# EAGLE design clock_board (EAGLE 7.5.0)
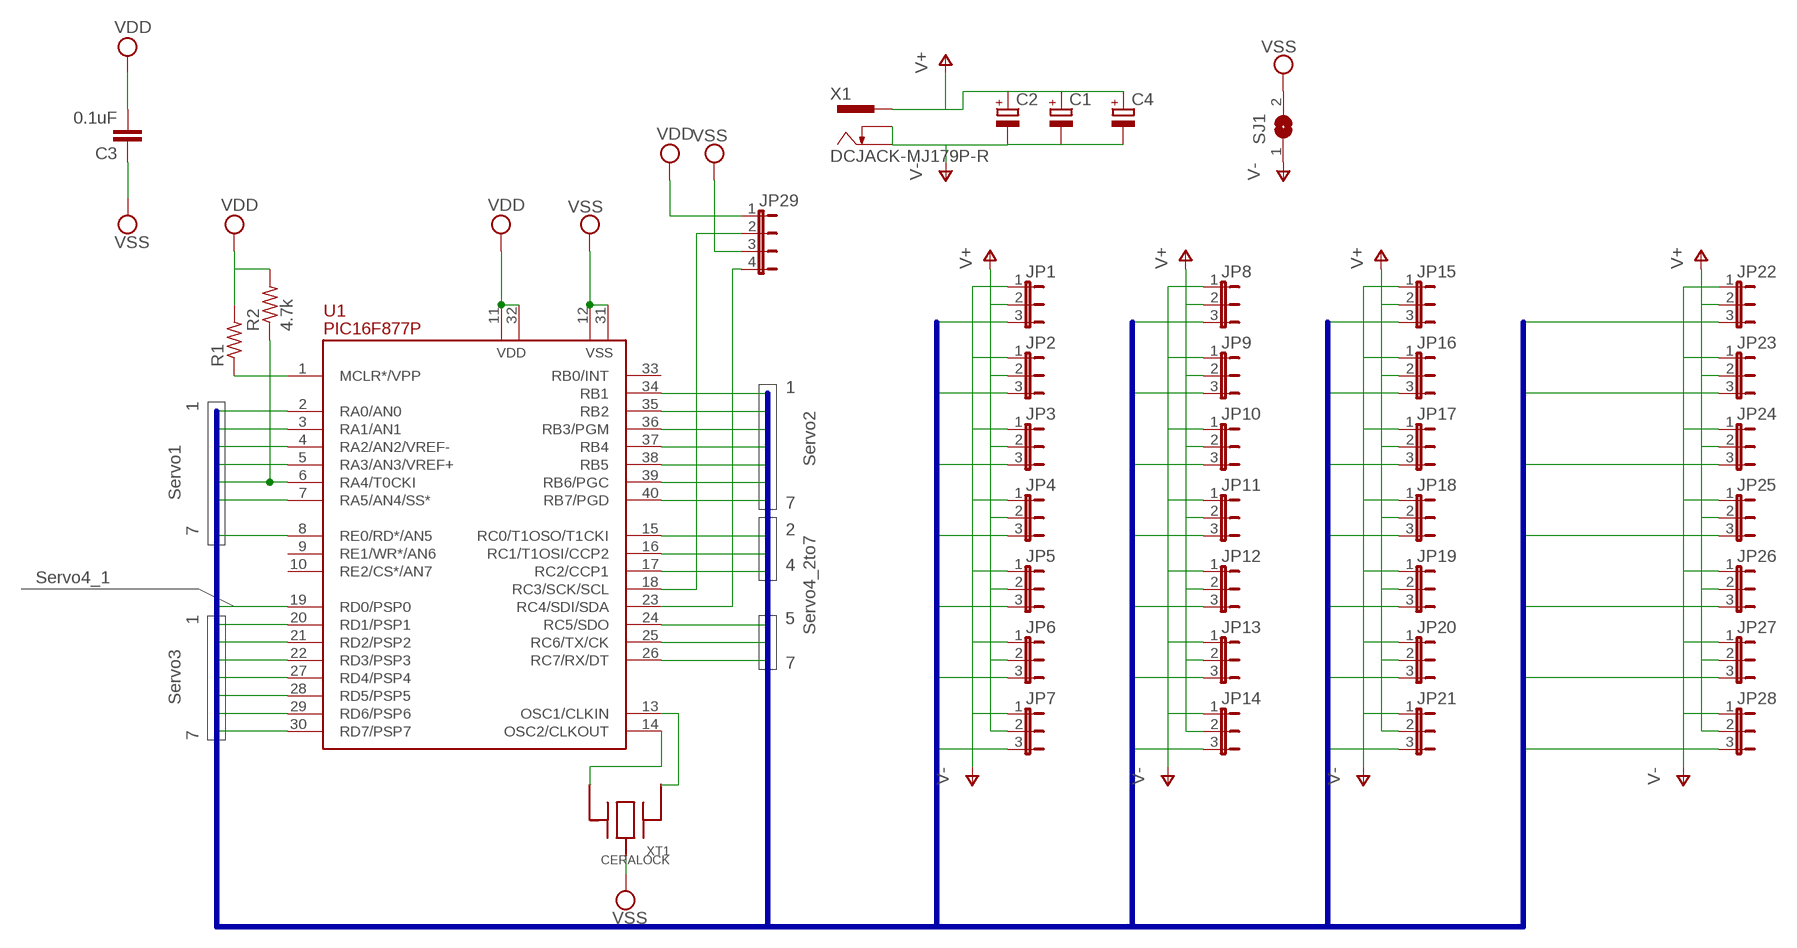
[diagram p0: schematic, sheet 1]

## Parts
C1  CPOL-EUE2.5-5  [E2,5-5]
C2  CPOL-EUE2.5-5  [E2,5-5]
C3  0.1uF  C-EU025-024X044  [C025-024X044]
C4  CPOL-EUE2.5-5  [E2,5-5]
JP1  JP2E  [JP2]
JP2  JP2E  [JP2]
JP3  JP2E  [JP2]
JP4  JP2E  [JP2]
JP5  JP2E  [JP2]
JP6  JP2E  [JP2]
JP7  JP2E  [JP2]
JP8  JP2E  [JP2]
JP9  JP2E  [JP2]
JP10  JP2E  [JP2]
JP11  JP2E  [JP2]
JP12  JP2E  [JP2]
JP13  JP2E  [JP2]
JP14  JP2E  [JP2]
JP15  JP2E  [JP2]
JP16  JP2E  [JP2]
JP17  JP2E  [JP2]
JP18  JP2E  [JP2]
JP19  JP2E  [JP2]
JP20  JP2E  [JP2]
JP21  JP2E  [JP2]
JP22  JP2E  [JP2]
JP23  JP2E  [JP2]
JP24  JP2E  [JP2]
JP25  JP2E  [JP2]
JP26  JP2E  [JP2]
JP27  JP2E  [JP2]
JP28  JP2E  [JP2]
JP29  JP4E  [JP4]
R1  R-US_0207/10  [0207/10]
R2  4.7k  R-US_0207/10  [0207/10]
SJ1  SJW  [SJW]
U1  PIC16F877P  [DIL40]
X1  DCJACK-MJ179P-R  [MJ-179P-R]
XT1  CERALOCK  [CERALOCK]

## Nets
N$1: U1.14(OSC2/CLKOUT) XT1.P$3
N$2: U1.13(OSC1/CLKIN) XT1.P$1
N$3: R1.1 U1.1(MCLR*/VPP)
N$4: JP29.2 U1.18(RC3/SCK/SCL)
N$5: JP29.4 U1.23(RC4/SDI/SDA)
SERVO0: JP1.3 U1.2(RA0/AN0)
SERVO1: JP2.3 U1.3(RA1/AN1)
SERVO2: JP3.3 U1.4(RA2/AN2/VREF-)
SERVO3: JP4.3 U1.5(RA3/AN3/VREF+)
SERVO4: JP5.3 R2.1 U1.6(RA4/T0CKI)
SERVO5: JP6.3 U1.7(RA5/AN4/SS*)
SERVO6: JP7.3 U1.8(RE0/RD*/AN5)
SERVO7: JP8.3 U1.34(RB1)
SERVO8: JP9.3 U1.35(RB2)
SERVO9: JP10.3 U1.36(RB3/PGM)
SERVO10: JP11.3 U1.37(RB4)
SERVO11: JP12.3 U1.38(RB5)
SERVO12: JP13.3 U1.39(RB6/PGC)
SERVO13: JP14.3 U1.40(RB7/PGD)
SERVO14: JP15.3 U1.20(RD1/PSP1)
SERVO15: JP16.3 U1.21(RD2/PSP2)
SERVO16: JP17.3 U1.22(RD3/PSP3)
SERVO17: JP18.3 U1.27(RD4/PSP4)
SERVO18: JP19.3 U1.28(RD5/PSP5)
SERVO19: JP20.3 U1.29(RD6/PSP6)
SERVO20: JP21.3 U1.30(RD7/PSP7)
SERVO21: JP22.3 U1.19(RD0/PSP0)
SERVO22: JP23.3 U1.15(RC0/T1OSO/T1CKI)
SERVO23: JP24.3 U1.16(RC1/T1OSI/CCP2)
SERVO24: JP25.3 U1.17(RC2/CCP1)
SERVO25: JP26.3 U1.24(RC5/SDO)
SERVO26: JP27.3 U1.25(RC6/TX/CK)
SERVO27: JP28.3 U1.26(RC7/RX/DT)
V+: C1.+ C2.+ C4.+ JP1.2 JP2.2 JP3.2 JP4.2 JP5.2 JP6.2 JP7.2 JP8.2 JP9.2 JP10.2 JP11.2 JP12.2 JP13.2 JP14.2 JP15.2 JP16.2 JP17.2 JP18.2 JP19.2 JP20.2 JP21.2 JP22.2 JP23.2 JP24.2 JP25.2 JP26.2 JP27.2 JP28.2 X1.1
V-: C1.- C2.- C4.- JP1.1 JP2.1 JP3.1 JP4.1 JP5.1 JP6.1 JP7.1 JP8.1 JP9.1 JP10.1 JP11.1 JP12.1 JP13.1 JP14.1 JP15.1 JP16.1 JP17.1 JP18.1 JP19.1 JP20.1 JP21.1 JP22.1 JP23.1 JP24.1 JP25.1 JP26.1 JP27.1 JP28.1 SJ1.1 X1.2 X1.3
VDD: C3.2 JP29.1 R1.2 R2.2 U1.11(VDD) U1.32(VDD)
VSS: C3.1 JP29.3 SJ1.2 U1.12(VSS) U1.31(VSS) XT1.P$2
Unconnected: U1.9(RE1/WR*/AN6) U1.10(RE2/CS*/AN7) U1.33(RB0/INT)

## Buses
SERVO[0..27]

## Notes on the sheet
- 1
- 1 | Servo2
- Servo1
- 7
- 7 | 2 | Servo4_2to7
- Servo4_1 | 4
- 1 | 5
- 7
- Servo3
- 7

## Library data of the parts
C1 C2 C4 = rcl:CPOL-EU: POLARIZED CAPACITOR, European symbol
C3 = rcl:C-EU: CAPACITOR, European symbol
JP1-JP28 = jumper:JP2E: JUMPER
JP29 = jumper:JP4E: JUMPER
R1 R2 = rcl:R-US_: RESISTOR, American symbol
SJ1 = jumper:SJ: SMD solder JUMPER
U1 = pic16f87x:PIC16F877: FLASH MICROCONTROLLER
X1 = dcjack:DCJACK: DC JACK 2.1mmφ - 5.5mmφ DCジャック、基板用。
XT1 = serolock:CERALOCK

## Board
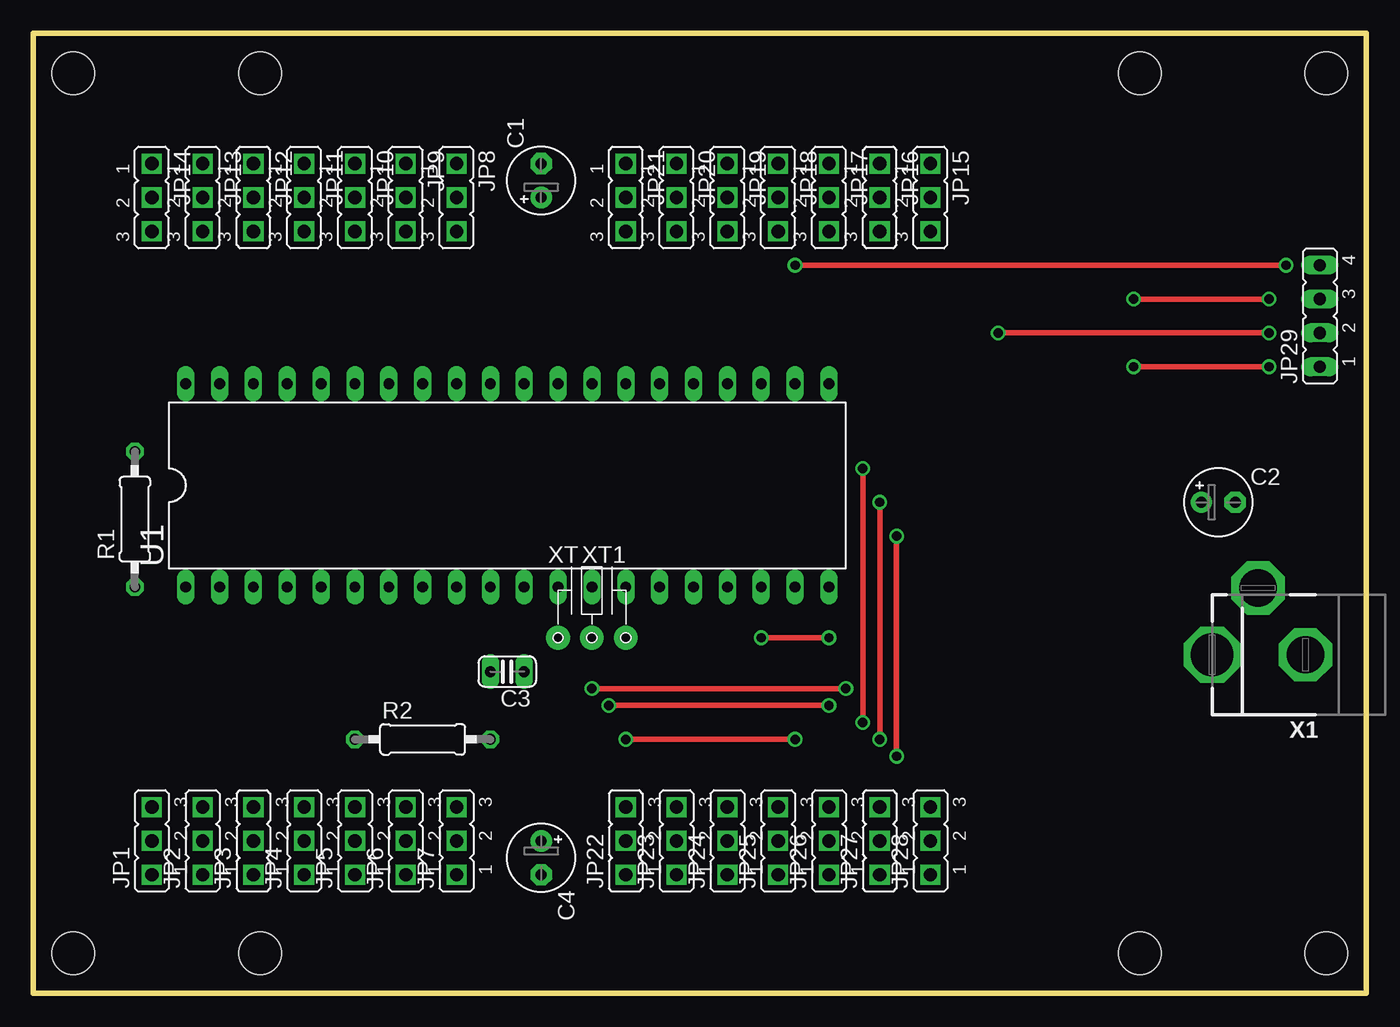
[diagram p1: board, top side]
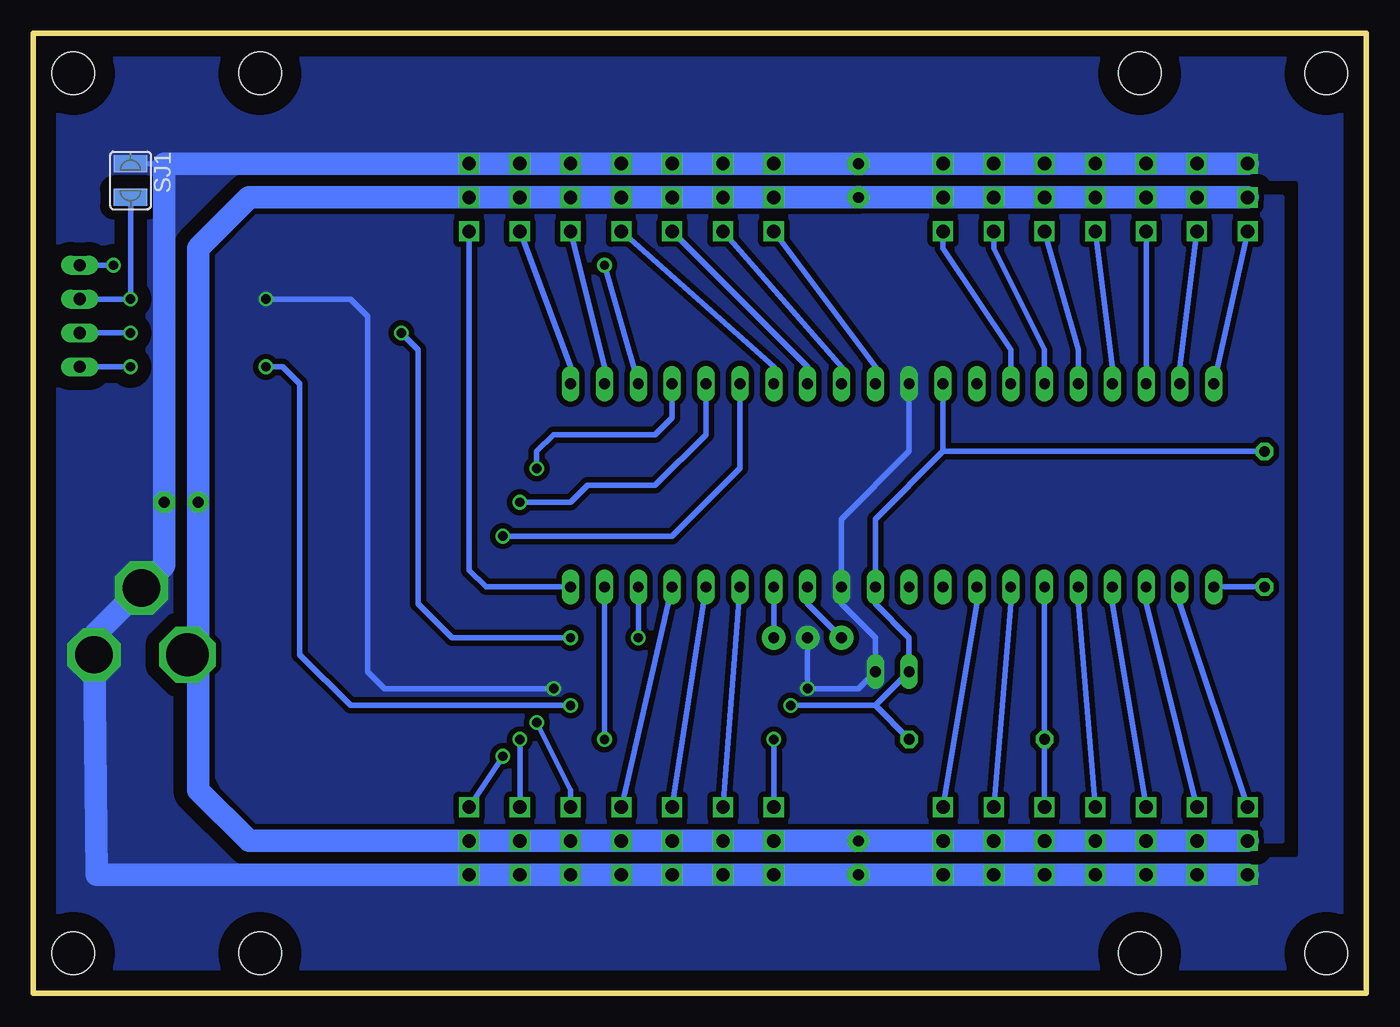
[diagram p2: board, bottom side, seen from below]

Size 100 x 72 mm. Coordinates in mm from the lower left corner, seen from the top.
Outline: 0,0 100,0 100,72 0,72 0,0
Copper layers (1*16): Top 0.035mm / dielectric 1.5mm / Bottom 0.035mm
Design rules "default *": minimum track width 16mil, minimum drill 24mil, track to track 0.3mm, track to pad 0.3mm, pad to pad 0.3mm, via to via 0.3mm, smd to smd 0.3mm, copper to edge 1.5mm, drill to drill 8mil, minimum pad ring 10mil, minimum via ring 8mil, stop-mask expansion 4mil, vias tented up to drill 0mil, thermal gap 10mil
Holes 3.2 mm at 3,3 97,3 3,69 97,69 17,69 17,3 83,3 83,69

### Footprints (pad centres in the part's own frame; a part is rotated, then mirrored left to right if it is on the bottom)
E2,5-5 = drill 0.813 pad 1.6: + -1.27,0 | drill 0.813 pad 1.6 octagon: - 1.27,0
C025-024X044 = drill 0.813 long: 1 -1.27,0; 2 1.27,0
JP2 = drill 1 square: 1 -2.54,0; 2 0,0; 3 2.54,0
JP4 = drill 0.914 long: 1 -3.81,0; 2 -1.27,0; 3 1.27,0; 4 3.81,0
0207/10 = drill 0.813 octagon: 1 -5.08,0; 2 5.08,0
SJW = smd 1.27 x 2.54: 1 -1.27,0; 2 1.27,0
DIL40 = drill 0.813 long: 1 -24.13,-7.62; 2 -21.59,-7.62; 3 -19.05,-7.62; 4 -16.51,-7.62; 5 -13.97,-7.62; 6 -11.43,-7.62; 7 -8.89,-7.62; 8 -6.35,-7.62; 9 -3.81,-7.62; 10 -1.27,-7.62; 11 1.27,-7.62; 12 3.81,-7.62; 13 6.35,-7.62; 14 8.89,-7.62; 15 11.43,-7.62; 16 13.97,-7.62; 17 16.51,-7.62; 18 19.05,-7.62; 19 21.59,-7.62; 20 24.13,-7.62; 21 24.13,7.62; 22 21.59,7.62; 23 19.05,7.62; 24 16.51,7.62; 25 13.97,7.62; 26 11.43,7.62; 27 8.89,7.62; 28 6.35,7.62; 29 3.81,7.62; 30 1.27,7.62; 31 -1.27,7.62; 32 -3.81,7.62; 33 -6.35,7.62; 34 -8.89,7.62; 35 -11.43,7.62; 36 -13.97,7.62; 37 -16.51,7.62; 38 -19.05,7.62; 39 -21.59,7.62; 40 -24.13,7.62
MJ-179P-R = drill 3.2 pad 4 octagon: 1 3,0 | drill 2.8 pad 4 octagon: 2 -4,0; 3 -0.45,-5
CERALOCK = drill 0.813 pad 1.778: P$1 -2.54,-3.81; P$2 0,-3.81; P$3 2.54,-3.81

### Placement (x,y rotation side)
C1  38.1,60.96 90 top
C2  88.9,36.83 0 top
C3  35.56,24.13 180 top
C4  38.1,10.16 270 top
JP1  8.89,11.43 90 top
JP2  12.7,11.43 90 top
JP3  16.51,11.43 90 top
JP4  20.32,11.43 90 top
JP5  24.13,11.43 90 top
JP6  27.94,11.43 90 top
JP7  31.75,11.43 90 top
JP8  31.75,59.69 270 top
JP9  27.94,59.69 270 top
JP10  24.13,59.69 270 top
JP11  20.32,59.69 270 top
JP12  16.51,59.69 270 top
JP13  12.7,59.69 270 top
JP14  8.89,59.69 270 top
JP15  67.31,59.69 270 top
JP16  63.5,59.69 270 top
JP17  59.69,59.69 270 top
JP18  55.88,59.69 270 top
JP19  52.07,59.69 270 top
JP20  48.26,59.69 270 top
JP21  44.45,59.69 270 top
JP22  44.45,11.43 90 top
JP23  48.26,11.43 90 top
JP24  52.07,11.43 90 top
JP25  55.88,11.43 90 top
JP26  59.69,11.43 90 top
JP27  63.5,11.43 90 top
JP28  67.31,11.43 90 top
JP29  96.52,50.8 90 top
R1  7.62,35.56 90 top
R2  29.21,19.05 0 top
SJ1  92.71,60.96 270 bottom
U1  35.56,38.1 0 top
X1  91.44,25.4 180 top
XT1  41.91,30.48 0 top

### Tracks (layer width: path | path; a pad name or v marks a point on that pad's centre or on a via)
N$1
  Bottom 0.406: XT1.P$3 U1.14
N$2
  Bottom 0.406: XT1.P$1 41.91,29.21 U1.13
N$3
  Bottom 0.406: R1.1 U1.1
N$4  (via drill 0.7)
  Top 0.406: v54.61,26.67 v59.69,26.67 | v72.39,49.53 v92.71,49.53
  Bottom 0.406: U1.18 v54.61,26.67 | v59.69,26.67 68.58,26.67 71.12,29.21 71.12,48.26 v72.39,49.53 | v92.71,49.53 JP29.2
N$5  (via drill 0.7)
  Top 0.406: v57.15,54.61 v93.98,54.61
  Bottom 0.406: U1.23 v57.15,54.61 | v93.98,54.61 JP29.4
SERVO0
  Bottom 0.406: U1.2 13.97,29.21 JP1.3
SERVO1
  Bottom 0.406: U1.3 16.51,29.21 JP2.3
SERVO2
  Bottom 0.406: U1.4 19.05,29.21 JP3.3
SERVO3
  Bottom 0.406: U1.5 21.59,29.21 JP4.3
SERVO4
  Bottom 0.406: U1.6 R2.1 JP5.3
SERVO5
  Bottom 0.406: U1.7 26.67,29.21 JP6.3
SERVO6
  Bottom 0.406: U1.8 29.21,29.21 JP7.3
SERVO7
  Bottom 0.406: U1.34 26.67,48.26 31.75,55.88 JP8.3
SERVO8
  Bottom 0.406: JP9.3 27.94,55.88 24.13,48.26 U1.35
SERVO9
  Bottom 0.406: U1.36 21.59,48.26 JP10.3
SERVO10
  Bottom 0.406: U1.37 19.05,46.99 JP11.3
SERVO11
  Bottom 0.406: U1.38 JP12.3
SERVO12
  Bottom 0.406: U1.39 13.97,46.99 JP13.3
SERVO13
  Bottom 0.406: JP14.3 U1.40
SERVO14
  Bottom 0.406: JP15.3 67.31,31.75 66.04,30.48 U1.20
SERVO15
  Bottom 0.406: U1.21 59.69,46.99 JP16.3
SERVO16
  Bottom 0.406: U1.22 57.15,46.99 JP17.3
SERVO17
  Bottom 0.406: U1.27 44.45,46.99 JP18.3
SERVO18
  Bottom 0.406: U1.28 41.91,46.99 JP19.3
SERVO19
  Bottom 0.406: U1.29 39.37,46.99 JP20.3
SERVO20
  Bottom 0.406: U1.30 36.83,46.99 JP21.3
SERVO21  (via drill 0.7)
  Top 0.406: v44.45,19.05 v57.15,19.05
  Bottom 0.406: JP22.3 v44.45,19.05 | U1.19 v57.15,19.05
SERVO22
  Bottom 0.406: U1.15 JP23.3
SERVO23
  Bottom 0.406: U1.16 JP24.3
SERVO24
  Bottom 0.406: U1.17 JP25.3
SERVO25  (via drill 0.7)
  Top 0.406: v62.23,20.32 v62.23,39.37
  Bottom 0.406: JP26.3 59.69,15.24 v62.23,20.32 | U1.24 52.07,43.18 53.34,41.91 60.96,41.91 62.23,40.64 v62.23,39.37
SERVO26  (via drill 0.7)
  Top 0.406: v63.5,36.83 v63.5,19.05
  Bottom 0.406: JP27.3 v63.5,19.05 | U1.25 49.53,41.91 53.34,38.1 58.42,38.1 59.69,36.83 v63.5,36.83
SERVO27  (via drill 0.7)
  Top 0.406: v64.77,17.78 v64.77,34.29
  Bottom 0.406: JP28.3 v64.77,17.78 | U1.26 46.99,39.37 52.07,34.29 v64.77,34.29
V+
  Bottom 0.406: 63.5,11.5 JP27.2
  Bottom 1.676: JP1.2 JP2.2 JP3.2 | 17.78,11.43 JP3.2 | JP3.2 JP4.2 JP5.2 JP6.2 JP7.2 C4.+ JP22.2 JP23.2 JP24.2 JP25.2 JP26.2 JP27.2 JP28.2 83.82,11.43 87.63,15.24 87.63,25.4 | X1.1 87.63,25.4 | 87.63,25.4 C2.+ 87.63,55.88 83.82,59.69 JP15.2 JP16.2 JP17.2 JP18.2 JP19.2 JP20.2 JP21.2 C1.+ JP8.2 JP9.2 JP10.2 JP11.2 JP12.2 JP13.2 JP14.2
V-
  Bottom 0.406: 63.5,9 JP27.1 | SJ1.1 90.17,62.23
  Bottom 1.676: JP1.1 JP2.1 JP3.1 JP4.1 JP5.1 JP6.1 JP7.1 C4.- JP22.1 JP23.1 | 49.53,8.89 JP23.1 | JP23.1 JP24.1 JP25.1 JP26.1 JP27.1 JP28.1 95.25,8.89 X1.2 95.44,26.85 X1.3 90.17,32.12 C2.- 90.17,62.23 JP15.1 JP16.1 JP17.1 JP18.1 | JP14.1 JP13.1 JP12.1 JP11.1 JP10.1 JP9.1 JP8.1 C1.- JP21.1 JP20.1 JP19.1 JP18.1 | 57.15,62.23 JP18.1
  pour Bottom (isolate 1.016, rank 2, no thermals): 0,71.12 0,0 100.33,0 100.33,71.12 1.27,71.12
VDD  (via drill 0.7)
  Top 0.406: v43.18,21.59 v59.69,21.59 | v82.55,46.99 v92.71,46.99
  Bottom 0.406: U1.32 31.75,40.64 | 31.75,40.64 36.83,35.56 U1.11 36.83,29.21 34.29,26.67 C3.2 36.83,21.59 | R1.2 31.75,40.64 | v92.71,46.99 JP29.1 | v59.69,21.59 76.2,21.59 80.01,25.4 80.01,45.72 81.28,46.99 v82.55,46.99 | 36.83,21.59 v43.18,21.59 | R2.2 36.83,21.59
VSS  (via drill 0.7)
  Top 0.406: v92.71,52.07 v82.55,52.07 | v41.91,22.86 v60.96,22.86
  Bottom 0.406: U1.31 34.29,40.64 39.37,35.56 U1.12 39.37,29.21 36.83,26.67 C3.1 38.1,22.86 v41.91,22.86 XT1.P$2 | v60.96,22.86 73.66,22.86 74.93,24.13 74.93,50.8 76.2,52.07 v82.55,52.07 | JP29.3 v92.71,52.07 SJ1.2
  pour Bottom (isolate 0.406, no thermals): 10.16,44.45 10.16,31.75 60.96,31.75 60.96,44.45
  pour Bottom (isolate 0.406, no thermals): 6.35,59.69 6.35,11.43 83.82,11.43 86.36,16.51 86.36,55.88 83.82,59.69